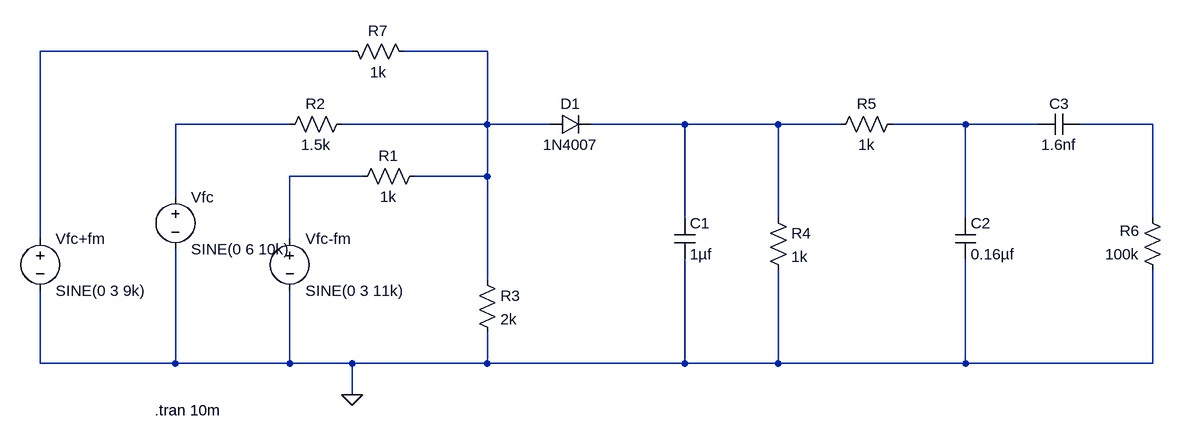
[diagram p0: schematic Day8_AM_Envelope_Detector .asc]
Day8_AM_Envelope_Detector .asc, the LTspice schematic file:
Version 4.1
SHEET 1 1540 680
WIRE 288 -16 -192 -16
WIRE 496 -16 368 -16
WIRE 192 96 16 96
WIRE 496 96 496 -16
WIRE 496 96 272 96
WIRE 592 96 496 96
WIRE 800 96 656 96
WIRE 944 96 800 96
WIRE 1040 96 944 96
WIRE 1232 96 1120 96
WIRE 1344 96 1232 96
WIRE 1520 96 1408 96
WIRE 304 176 192 176
WIRE 496 176 496 96
WIRE 496 176 384 176
WIRE 16 208 16 96
WIRE 800 240 800 96
WIRE 944 240 944 96
WIRE 1232 240 1232 96
WIRE 1520 240 1520 96
WIRE -192 272 -192 -16
WIRE 192 272 192 176
WIRE 496 336 496 176
WIRE -192 464 -192 352
WIRE 16 464 16 288
WIRE 16 464 -192 464
WIRE 192 464 192 352
WIRE 192 464 16 464
WIRE 288 464 192 464
WIRE 496 464 496 416
WIRE 496 464 288 464
WIRE 800 464 800 304
WIRE 800 464 496 464
WIRE 944 464 944 320
WIRE 944 464 800 464
WIRE 1232 464 1232 304
WIRE 1232 464 944 464
WIRE 1520 464 1520 320
WIRE 1520 464 1232 464
WIRE 288 512 288 464
FLAG 288 512 0
SYMBOL voltage 16 192 R0
WINDOW 123 0 0 Left 0
WINDOW 39 0 0 Left 0
SYMATTR InstName Vfc
SYMATTR Value SINE(0 6 10k)
SYMBOL voltage 192 256 R0
WINDOW 123 0 0 Left 0
WINDOW 39 0 0 Left 0
SYMATTR InstName Vfc-fm
SYMATTR Value SINE(0 3 11k)
SYMBOL res 400 160 R90
WINDOW 0 0 56 VBottom 2
WINDOW 3 32 56 VTop 2
SYMATTR InstName R1
SYMATTR Value 1k
SYMBOL res 288 80 R90
WINDOW 0 0 56 VBottom 2
WINDOW 3 32 56 VTop 2
SYMATTR InstName R2
SYMATTR Value 1.5k
SYMBOL res 480 320 R0
SYMATTR InstName R3
SYMATTR Value 2k
SYMBOL diode 592 112 R270
WINDOW 0 32 32 VTop 2
WINDOW 3 0 32 VBottom 2
SYMATTR InstName D1
SYMATTR Value 1N4007
SYMBOL cap 784 240 R0
SYMATTR InstName C1
SYMATTR Value 1µf
SYMBOL res 928 224 R0
SYMATTR InstName R4
SYMATTR Value 1k
SYMBOL res 1136 80 R90
WINDOW 0 0 56 VBottom 2
WINDOW 3 32 56 VTop 2
SYMATTR InstName R5
SYMATTR Value 1k
SYMBOL cap 1216 240 R0
SYMATTR InstName C2
SYMATTR Value 0.16µf
SYMBOL cap 1408 80 R90
WINDOW 0 0 32 VBottom 2
WINDOW 3 32 32 VTop 2
SYMATTR InstName C3
SYMATTR Value 1.6nf
SYMBOL res 1536 336 R180
WINDOW 0 36 76 Left 2
WINDOW 3 36 40 Left 2
SYMATTR InstName R6
SYMATTR Value 100k
SYMBOL voltage -192 256 R0
WINDOW 123 0 0 Left 0
WINDOW 39 0 0 Left 0
SYMATTR InstName Vfc+fm
SYMATTR Value SINE(0 3 9k)
SYMBOL res 272 -32 M90
WINDOW 0 0 56 VBottom 2
WINDOW 3 32 56 VTop 2
SYMATTR InstName R7
SYMATTR Value 1k
TEXT -16 536 Left 2 !.tran 10m

The netlist it stands for:
* Day8_AM_Envelope_Detector .asc
Vfc N003 0 SINE(0 6 10k)
Vfc-fm N007 0 SINE(0 3 11k)
R1 N002 N007 1k
R2 N002 N003 1.5k
R3 N002 0 2k
D1 N002 N004 1N4007
C1 N004 0 1µf
R4 N004 0 1k
R5 N005 N004 1k
C2 N005 0 0.16µf
C3 N006 N005 1.6nf
R6 0 N006 100k
Vfc+fm N001 0 SINE(0 3 9k)
R7 N001 N002 1k
.model D D
.lib standard.dio
.tran 10m
.backanno
.end